# Altium project PCB_Spectrum_Analyzer.PrjPcb
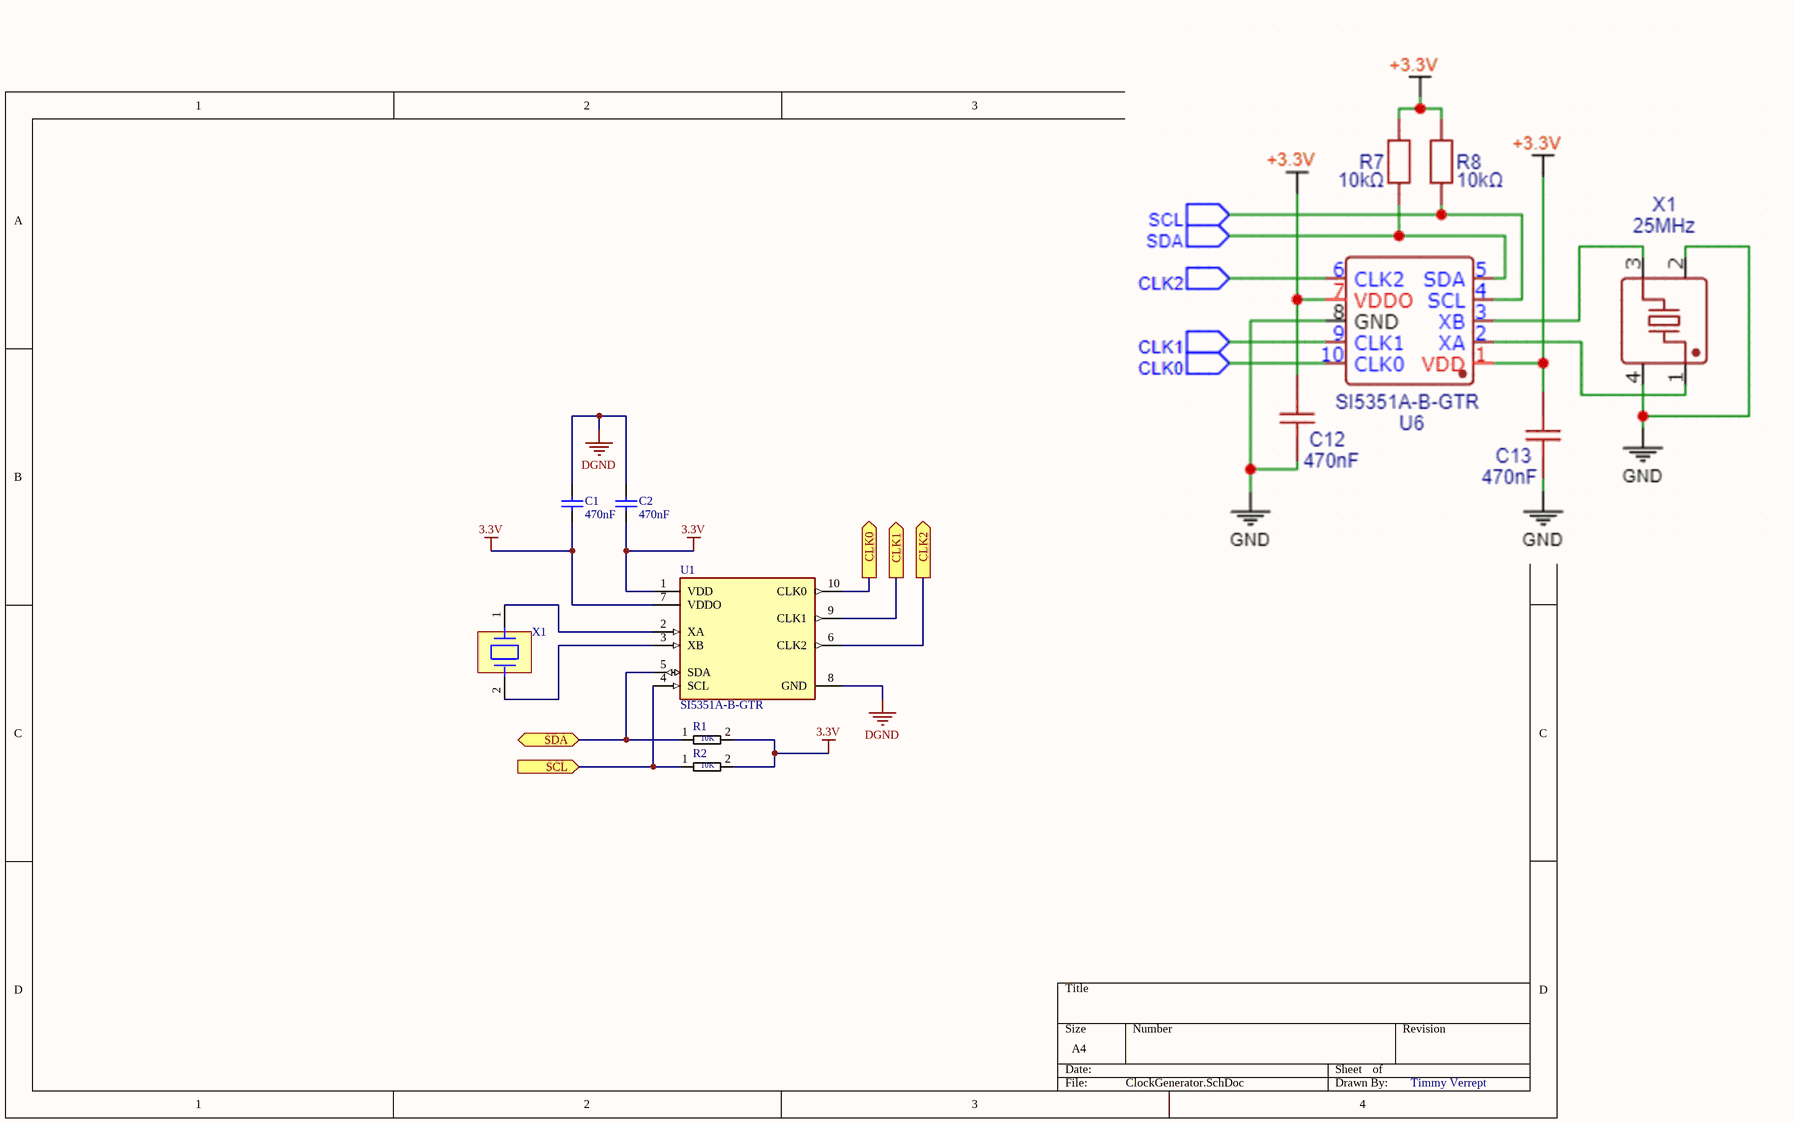
[diagram p0: ClockGenerator.SchDoc]
5 sheets, 74 parts. Net scope: flat (ports and power ports of the same name join across sheets).
Board file: Pcb_SpectrumAnalyzer.PcbDoc
Sheets:
  ClockGenerator.SchDoc
  AudioFrontend.SchDoc
  SpectrumAnalyzer.SchDoc
  ESP32-Controls.SchDoc
  BluetoothModule.SchDoc

## Sheet ClockGenerator.SchDoc
size A4; SheetNumber: 1; SheetTotal: 5

### Parts
C1  470nF  [SMD_CAPACITOR]
C2  470nF  [SMD_CAPACITOR]
R1  10K  [SMD_RESISTOR]
R2  10K  [SMD_RESISTOR]
U1  SI5351A-B-GTR  [ClockGenerator]
X1  ABM8W-25.0000MHZ-8-D1X-T3  [Crystal]  (value not drawn)

### Ports
CLK0 (out, see SpectrumAnalyzer[3A]), CLK1 (out, see SpectrumAnalyzer[3B]), CLK2 (out, see SpectrumAnalyzer[3C]), SCL (in, see ESP32-Controls[1B]), SDA (bidir, see ESP32-Controls[1B])

### Nets
3.3V: C1.1 C2.1 R1.2 R2.2 U1.1(VDD) U1.7(VDDO)
DGND: C1.2 C2.2 U1.8(GND)
NetESP32_4: R1.1 U1.5(SDA) ; port SDA
NetESP32_5: R2.1 U1.4(SCL) ; port SCL
NetU1_2: U1.2(XA) X1.1
NetU1_3: U1.3(XB) X1.2
NetU1_6: U1.6(CLK2) ; port CLK2
NetU1_9: U1.9(CLK1) ; port CLK1
NetU1_10: U1.10(CLK0) ; port CLK0

### Notes on the sheet
- Timmy Verrept

### Library data of the parts
C1 C2 = CER Capacitor: Manufacturer: Vitramon; Part Number: VJ0805Y682KXAMT
R1 R2 = Resistor: RES SMD 681 OHM 0.1% 1/8W 0805; Manufacturer: Yageo; Manufacturer Part Number: RT0805BRD07681RL; Value: 681Ω; Temperature Coefficient: 25 ppm/°C; Power Rating: 0.125W; Voltage Rating: 150V; Tolerance: 0.0025; ComponentLink2URL: http://www.yageo.com/documents/recent/PYu-RT_1-to-0.01_RoHS_L_9.pdf; Ipc Land Pattern Name: RESC200125X50; Footprint Url: http://www.yageo.com/exep/pages/download/literatures/PYu-R_Mount_10.pdf; Temperature: -55°C to +155°C; Resistance: 681Ω; Mouser Description: Thin Film Resistors - SMD 1/8W 681 ohm .1% 25ppm; Temperature Range High: +155°C; Device Class L3: Chip SMD Resistors; Automotive: No; Octopart: https://octopart.com/rt0805brd07681rl-yageo-1270194; Device Class L1: Passive Components; Package: RT0805; Device Class L2: Resistors; Category: Res; RoHS: TRUE; Composition: Thin Film; ComponentLink2Description: Datasheet; Temperature Range Low: -55°C; Lead Free: Yes; Digikey Description: RES SMD 681 OHM 0.1% 1/8W 0805; Height: 0.6mm; Series: RT
U1 = Clock Generator: IC CLK GENERATOR 200MHZ 10MSOP; PLL: Yes; Number of Circuits: 2; Max Duty Cycle: 55%; Operating Supply Voltage: 3.3V; Input: Crystal; Number of Outputs: 3; Operating Supply Current: 22mA; Packaging: Tape and Reel; Max Frequency: 200MHz; Min Operating Temperature: -40°C; Case/Package: MSOP; Mount: Surface Mount; Max Operating Temperature: 85°C; RoHS Compliant: Yes; Series: MultiSynth™; Number of Pins: 10; Package Quantity: 2500
X1 = Crystal: Crystal 25.0000Mhz 8Pf Smd Rohs Compliant: Yes |Abracon ABM8W-25.0000MHZ-8-D1X-T3; Symbol Hash: 5ad2309f83030e0db84e76142195c3471039205ed86bf5db55117304b0c05392; Frequency: 25MHz; Tolerance: 10ppm; Verification Version: 0.0.0.3; Stability: 20ppm; Esr: 50Ω; Mouser Part Number: 815-8W25-8D1XT; Mouser Description: Crystal 25.0000Mhz 8Pf Smd Rohs Compliant: Yes |Abracon ABM8W-25.0000MHZ-8-D1X-T3; Datasheet Date: 2022-07-11; Temperature Range High: +85°C; Part Number: ABM8W-25.0000MHZ-8-D1X-T3; Digikey Description: CRYSTAL 25.0000MHZ 8PF SMD; Digikey Part Number: 535-14059-1-ND; ComponentLink2URL: https://abracon.com/datasheets/ABM8W.pdf; ComponentLink2Description: Datasheet URL; Lead Free: Yes; Height: 0.75mm; Automotive: No; Temperature Range Low: -40°C; RoHS: Compliant; Manufacturer: Abracon; Package: ABM8W; Load Capacitance: 8pF; Series: ABM8W; ComponentLink1Description: Upverter; Supplier 2: Mouser; Supplier 1: Digi-Key; ComponentLink1URL: https://upverter.com/part/id/6105b10e08f999b5/; Supplier Part Number 2: 815-8W25-8D1XT; Supplier Part Number 1: 535-14059-1-ND; HelpURL: https://abracon.com/datasheets/ABM8W.pdf; Temperature: -40°C to +85°C; Schedule B: 8541600080

## Sheet AudioFrontend.SchDoc
size A4; SheetNumber: 2; SheetTotal: 5
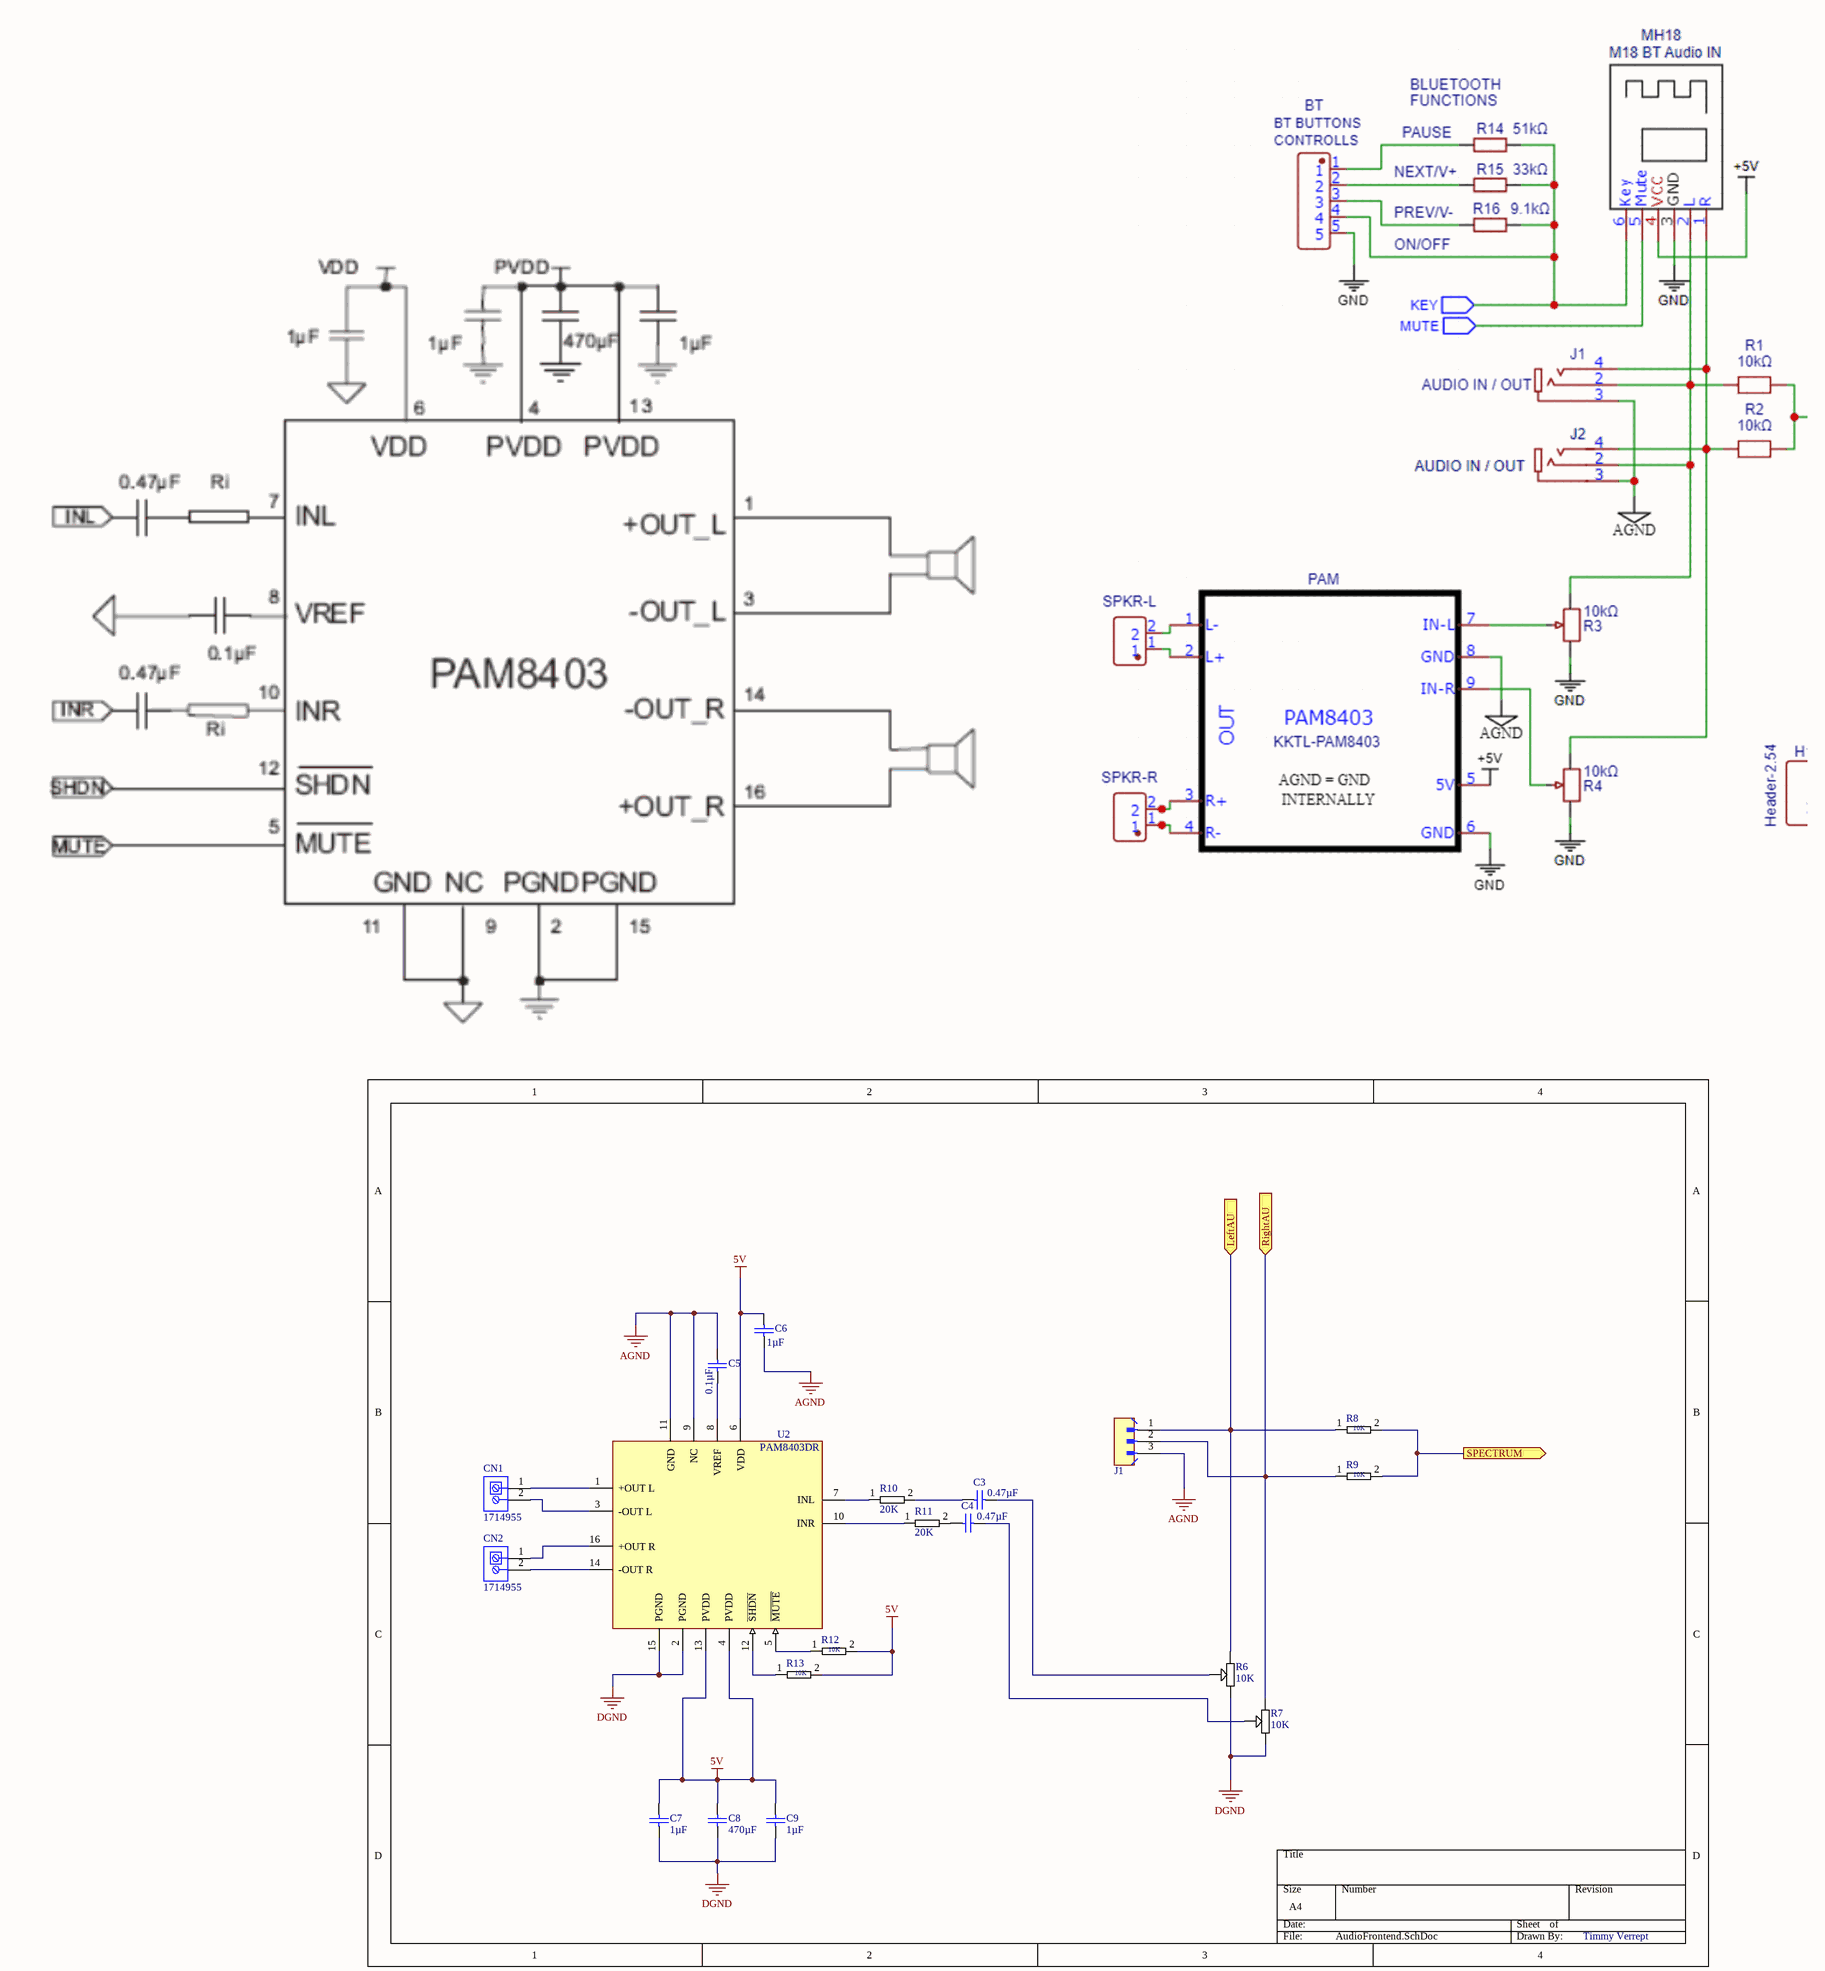
[diagram p1: AudioFrontend.SchDoc]

### Parts
C3  0.47µF  [SMD_CAPACITOR]
C4  0.47µF  [SMD_CAPACITOR]
C5  0.1µF  [SMD_CAPACITOR]
C6  1µF  [SMD_CAPACITOR]
C7  1µF  [SMD_CAPACITOR]
C8  470µF  [SMD_CAPACITOR]
C9  1µF  [SMD_CAPACITOR]
CN1  1714955  [SchroefConnector2P]
CN2  1714955  [SchroefConnector2P]
J1  B3B-PH-K-S  [Connector3P]  (value not drawn)
R6  10K  [POTENTIOMETER]
R7  10K  [POTENTIOMETER]
R8  10K  [SMD_RESISTOR]
R9  10K  [SMD_RESISTOR]
R10  20K  [SMD_RESISTOR]
R11  20K  [SMD_RESISTOR]
R12  10K  [SMD_RESISTOR]
R13  10K  [SMD_RESISTOR]
U2  PAM8403DR  [PAM8403]

### Ports
LeftAU (in, see BluetoothModule[4C]), RightAU (in, see BluetoothModule[4C]), SPECTRUM (out, see SpectrumAnalyzer[1B])

### Nets
5V: C6.1 C7.1 C8.1 C9.1 R12.2 R13.2 U2.4(PVDD) U2.6(VDD) U2.13(PVDD)
AGND: C5.1 C6.2 J1.3 U2.9(NC) U2.11(GND)
DGND: C7.2 C8.2 C9.2 R6.3 R7.3 U2.2(PGND) U2.15(PGND)
NetC3_1: C3.1 R10.2
NetC3_2: C3.2 R6.2
NetC4_1: C4.1 R11.2
NetC4_2: C4.2 R7.2
NetC5_2: C5.2 U2.8(VREF)
NetC16_2: R8.2 R9.2 ; port SPECTRUM
NetCN1_1: CN1.1 U2.1(+OUT_L)
NetCN1_2: CN1.2 U2.3(-OUT_L)
NetCN2_1: CN2.1 U2.16(+OUT_R)
NetCN2_2: CN2.2 U2.14(-OUT_R)
NetJ1_1: J1.1 R6.1 R8.1 ; port LeftAU
NetJ1_2: J1.2 R7.1 R9.1 ; port RightAU
NetR10_1: R10.1 U2.7(INL)
NetR11_1: R11.1 U2.10(INR)
NetR12_1: R12.1 U2.5(~{MUTE})
NetR13_1: R13.1 U2.12(~{SHDN})

### Notes on the sheet
- Timmy Verrept

### Library data of the parts
C3-C9 = CER Capacitor: as C1 on sheet ClockGenerator
CN1 CN2 = schroefconnector 2 pins: PC Terminal Block, Pitch 6.35 mm, 1 x 2 Position, Height 21.5 mm, Tail Lenght 5.1 mm, RoHS, Bulk; Manufacturer: Phoenix Contact; Package Description: PC Terminal Block, Pitch 6.35 mm, 1 x 2 Position, Height 21.5 mm, Tail Lenght 5.1 mm; Datasheet URL: http://media.digikey.com/pdf/Data%20Sheets/Phoenix%20Contact%20PDFs/1714955.pdf; Package Reference: 1714955; Manufacturer URL: http://www.phoenixcontact.com/; Datasheet Version: 02/2010; Mounting Technology: ThroughHole
J1 = Connector_3p: MF: {'manufacturer': u'JST Sales America Inc.'}; Package: None; Price: None; Value: *; MP: B3B-PH-K-S; Availability: Unavailable
R6 R7 = Potmeter: 16mm Rotary Potentiometers / WH148-1A-2-18T-L20; MF: Kls electronics; SnapEDA_Link: https://www.snapeda.com/parts/WH148-1A-2-18T-L20/Kls+electronics/view-part/?ref=snap; Package: Package; Value: *; MP: WH148-1A-2-18T-L20; Check_prices: https://www.snapeda.com/parts/WH148-1A-2-18T-L20/Kls+electronics/view-part/?ref=eda
R8-R13 = Resistor: as R1 on sheet ClockGenerator; ComponentLink2URL: http://www.yageo.com/documents/recent/PYu-RT_1-to-0.01_RoHS_L_9.pdf; Ipc Land Pattern Name: RESC200125X50; Footprint Url: http://www.yageo.com/exep/pages/download/literatures/PYu-R_Mount_10.pdf; Temperature: -55°C to +155°C; Resistance: 681Ω; Mouser Description: Thin Film Resistors - SMD 1/8W 681 ohm .1% 25ppm; Temperature Range High: +155°C; Device Class L3: Chip SMD Resistors; Automotive: No; Octopart: https://octopart.com/rt0805brd07681rl-yageo-1270194; Device Class L1: Passive Components; Package: RT0805; Device Class L2: Resistors; Category: Res; RoHS: TRUE; Composition: Thin Film; ComponentLink2Description: Datasheet; Temperature Range Low: -55°C; Lead Free: Yes; Digikey Description: RES SMD 681 OHM 0.1% 1/8W 0805; Height: 0.6mm; Series: RT
U2 = Pam8403: IC AMP CLASS D STEREO 3W 16SOP; Manufacturer: Diodes Inc.; Min Supply Voltage: 2.5V; Standoff Height: 0.1mm; Max Junction Temp: +125°C; Number Of Channels: 2; Power At Speaker R: 3.2W @ 4Ω; Nominal Supply Current: 8-16mA; Max Supply Voltage: 5.5V; Package: SO-16; Device Class L3: Amplifiers - Audio; Ipc Land Pattern Name: SOIC127P600X119-16; ComponentLink2URL: https://www.diodes.com/assets/Datasheets/PAM8403.pdf; Automotive: No; ComponentLink2Description: Datasheet; Device Class L1: Integrated Circuits (ICs); Digikey Description: IC AMP CLASS D STEREO 3W 16SOP; Temperature Range High: +85°C; Mouser Description: PAM8403 Series 5.5 V 3 W Filterless Class-D Stereo Audio Amplifier - SOIC-16; RoHS: TRUE; Temperature: -40°C to +85°C; Temperature Range Low: -40°C; Manufacturer Part Number: PAM8403DR; Octopart: https://octopart.com/pam8403dr-diodes+inc.-29030487; Device Class L2: Linear ICs; Category: IC; Footprint Url: https://www.diodes.com/assets/Package-Files/SO-16.pdf; Lead Free: Yes; Height: 1.26mm

## Sheet SpectrumAnalyzer.SchDoc
size A4; SheetNumber: 3; SheetTotal: 5
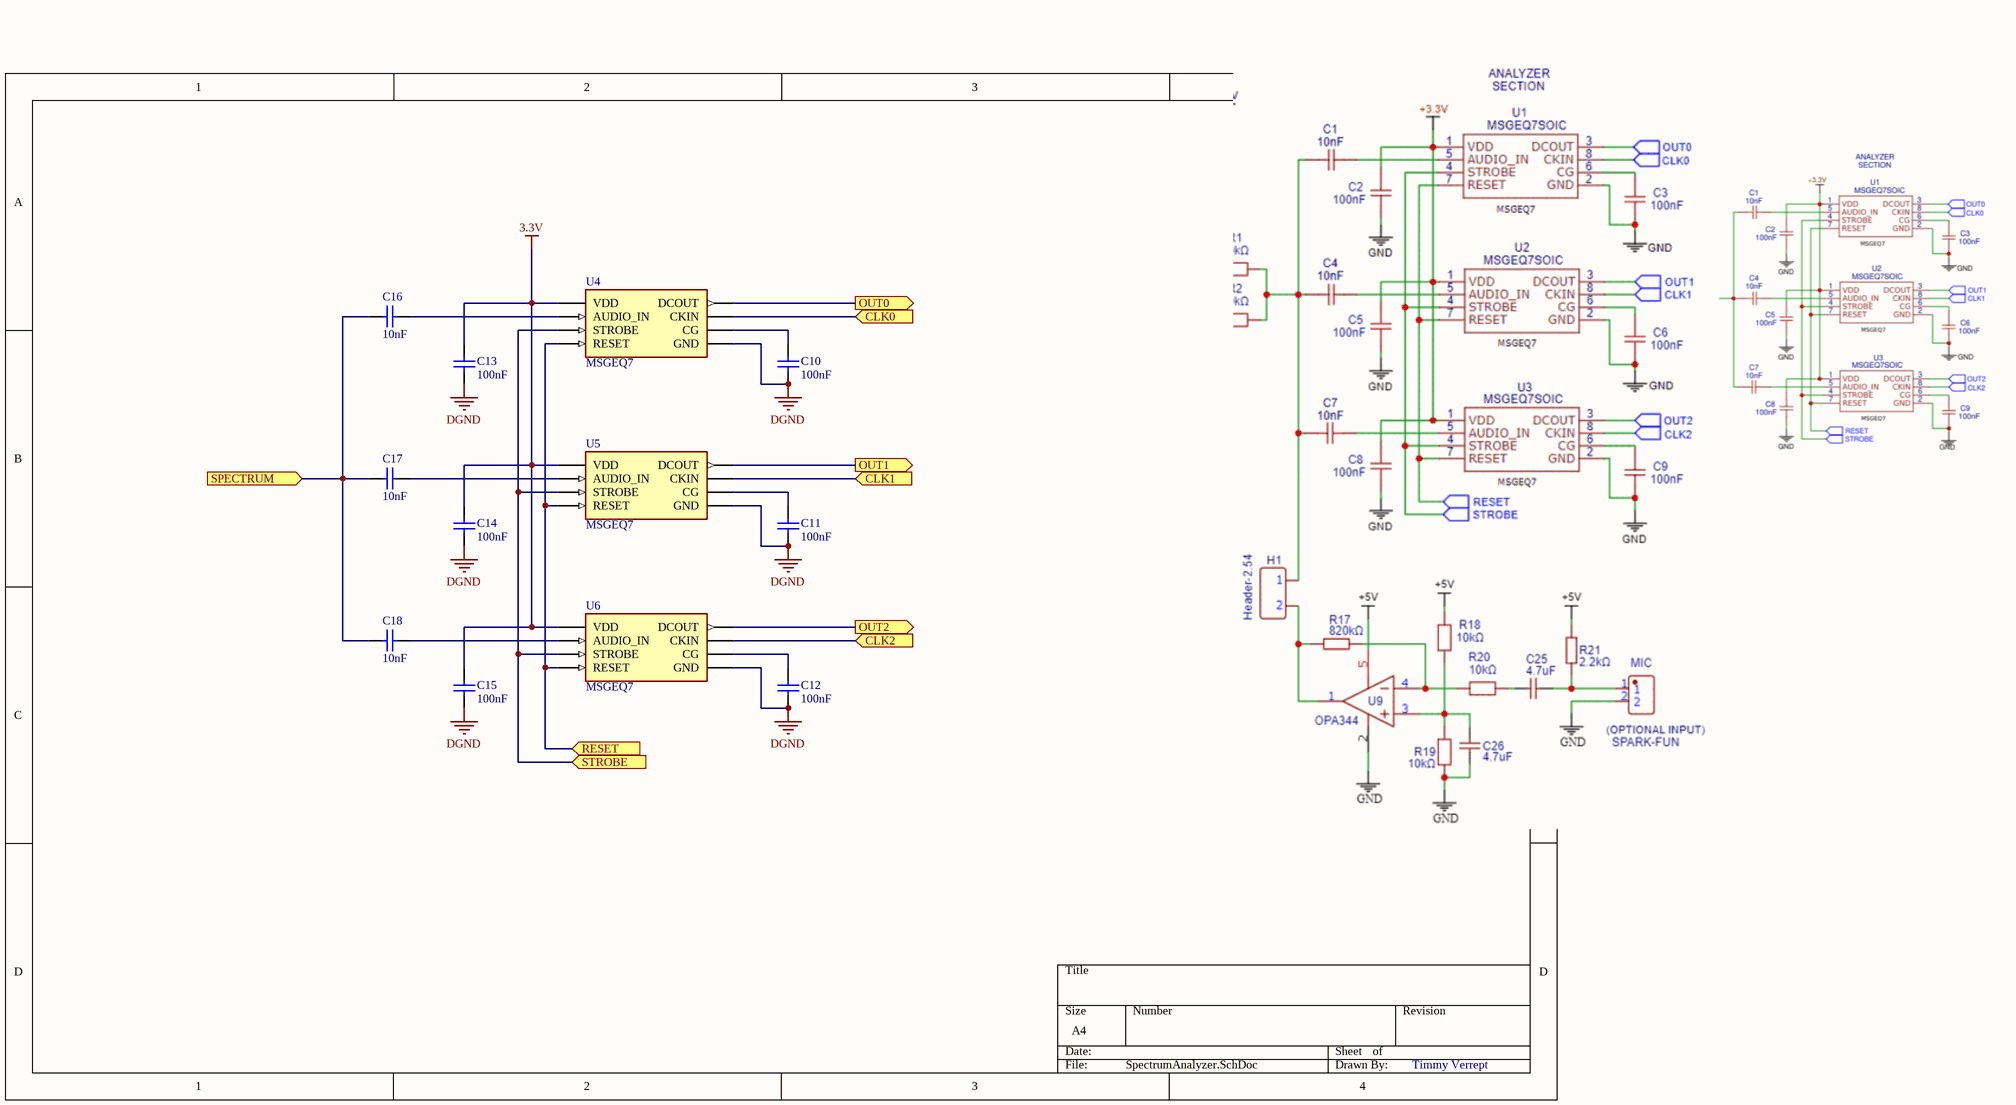
[diagram p2: SpectrumAnalyzer.SchDoc]

### Parts
C10  100nF  [SMD_CAPACITOR]
C11  100nF  [SMD_CAPACITOR]
C12  100nF  [SMD_CAPACITOR]
C13  100nF  [SMD_CAPACITOR]
C14  100nF  [SMD_CAPACITOR]
C15  100nF  [SMD_CAPACITOR]
C16  10nF  [SMD_CAPACITOR]
C17  10nF  [SMD_CAPACITOR]
C18  10nF  [SMD_CAPACITOR]
U4  MSGEQ7  [MSGEQ7]
U5  MSGEQ7  [MSGEQ7]
U6  MSGEQ7  [MSGEQ7]

### Ports
CLK0 (in, see ClockGenerator[3B]), CLK1 (in, see ClockGenerator[3B]), CLK2 (in, see ClockGenerator[3B]), OUT0 (out, see ESP32-Controls[2B]), OUT1 (out, see ESP32-Controls[2B]), OUT2 (out, see ESP32-Controls[2B]), RESET (in, see ESP32-Controls[1B]), SPECTRUM (in, see AudioFrontend[4B]), STROBE (in, see ESP32-Controls[1B])

### Nets
3.3V: C13.2 C14.2 C15.2 U4.1(VDD) U5.1(VDD) U6.1(VDD)
DGND: C10.1 C11.1 C12.1 C13.1 C14.1 C15.1 U4.2(GND) U5.2(GND) U6.2(GND)
NetC10_2: C10.2 U4.6(CG)
NetC11_2: C11.2 U5.6(CG)
NetC12_2: C12.2 U6.6(CG)
NetC16_1: C16.1 U4.5(AUDIO_IN)
NetC16_2: C16.2 C17.2 C18.2 ; port SPECTRUM
NetC17_1: C17.1 U5.5(AUDIO_IN)
NetC18_1: C18.1 U6.5(AUDIO_IN)
NetESP32_8: U4.7(RESET) U5.7(RESET) U6.7(RESET) ; port RESET
NetESP32_9: U4.4(STROBE) U5.4(STROBE) U6.4(STROBE) ; port STROBE
NetESP32_16: U6.3(DCOUT) ; port OUT2
NetESP32_17: U5.3(DCOUT) ; port OUT1
NetESP32_18: U4.3(DCOUT) ; port OUT0
NetU1_6: U6.8(CKIN) ; port CLK2
NetU1_9: U5.8(CKIN) ; port CLK1
NetU1_10: U4.8(CKIN) ; port CLK0

### Notes on the sheet
- Timmy Verrept

### Library data of the parts
C10-C18 = CER Capacitor: as C1 on sheet ClockGenerator
U4-U6 = MSGEQ7: MSGEQ7 Signal Level Control Interface Arduino Platform Evaluation Expansion Board; MF: SparkFun Electronics; Price: None; Availability: Unavailable; SnapEDA_Link: https://www.snapeda.com/parts/MSGEQ7/SparkFun%20Electronics/view-part/106617/?ref=snap; Value: *; Package: SOIC-8 Mixed Signal Integration; MP: MSGEQ7

## Sheet ESP32-Controls.SchDoc
size A4; SheetNumber: 4; SheetTotal: 5
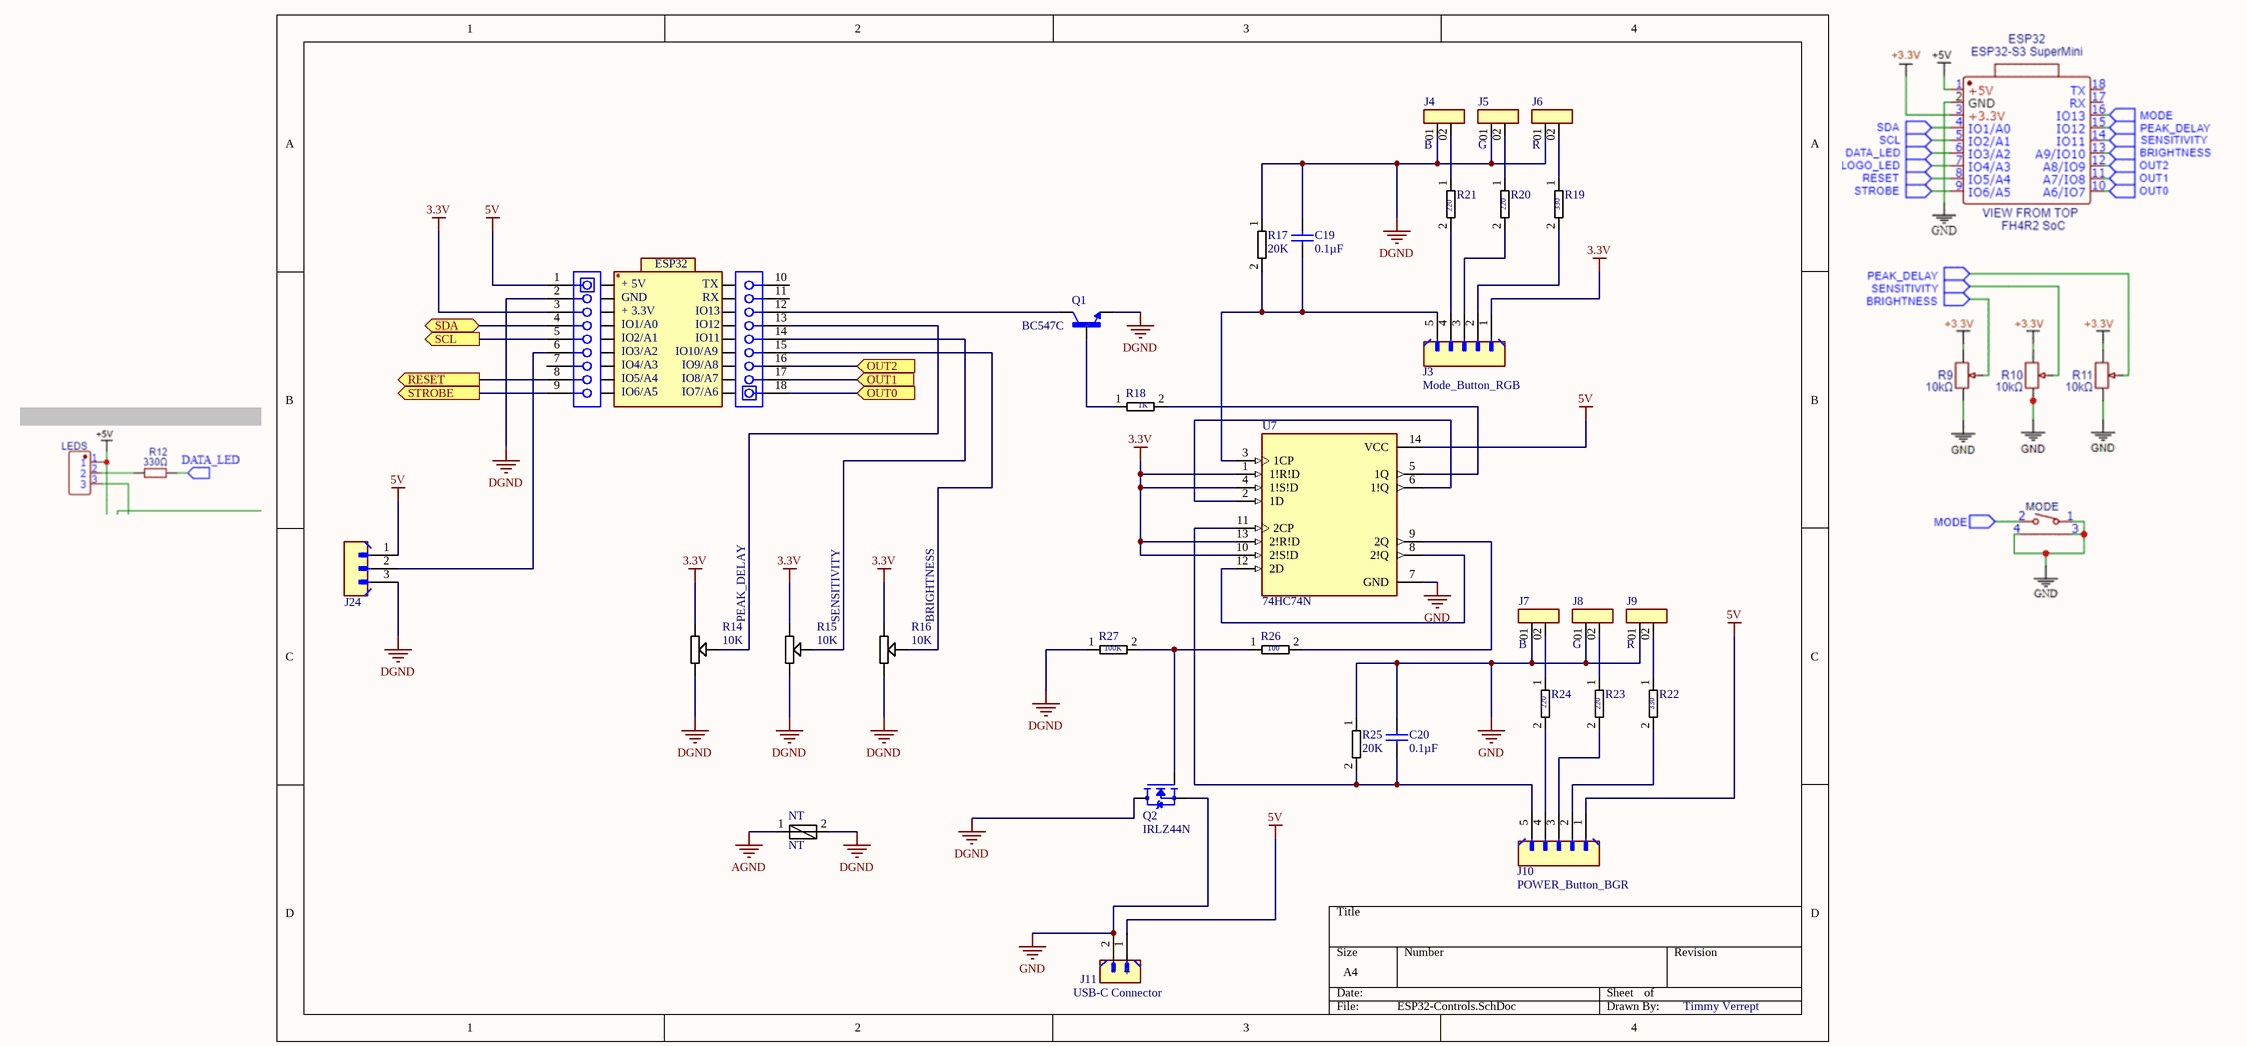
[diagram p3: ESP32-Controls.SchDoc]

### Parts
C19  0.1µF  [SMD_CAPACITOR]
C20  0.1µF  [SMD_CAPACITOR]
ESP32  ESP32_Placeholder  [ESP32_placeholder]  (value not drawn)
J3  Mode_Button_RGB  [Connector5P]
J4  B  [MaleHeader2P]
J5  G  [MaleHeader2P]
J6  R  [MaleHeader2P]
J7  B  [MaleHeader2P]
J8  G  [MaleHeader2P]
J9  R  [MaleHeader2P]
J10  POWER_Button_BGR  [Connector5P]
J11  USB-C Connector  [JST_B2B-PH-K-S]
J24  B3B-PH-K-S  [Connector3P]  (value not drawn)
NT  NT  [NT]
Q1  BC547C  [Transistor]
Q2  IRLZ44N  [MOSFET]
R14  10K  [POTENTIOMETER]
R15  10K  [POTENTIOMETER]
R16  10K  [POTENTIOMETER]
R17  20K  [SMD_RESISTOR]
R18  1K  [SMD_RESISTOR]
R19  330  [SMD_RESISTOR]
R20  220  [SMD_RESISTOR]
R21  220  [SMD_RESISTOR]
R22  330  [SMD_RESISTOR]
R23  220  [SMD_RESISTOR]
R24  220  [SMD_RESISTOR]
R25  20K  [SMD_RESISTOR]
R26  100  [SMD_RESISTOR]
R27  100K  [SMD_RESISTOR]
U7  74HC74N  [74HC74]

### Ports
OUT0 (in, see SpectrumAnalyzer[3A]), OUT1 (in, see SpectrumAnalyzer[3B]), OUT2 (in, see SpectrumAnalyzer[3C]), RESET (out, see SpectrumAnalyzer[2C]), SCL (out, see ClockGenerator[2C]), SDA (bidir, see ClockGenerator[2C]), STROBE (out, see SpectrumAnalyzer[2C])

### Nets
3.3V: ESP32.3 J3.1 R14.3 R15.3 R16.3 U7.1(1!R!D) U7.4(1!S!D) U7.10(2!S!D) U7.13(2!R!D)
5V: ESP32.1 J10.1 J11.1(+) J24.1 U7.14(VCC)
AGND: NT.1
DGND: C19.1 ESP32.2 J4.01 J5.01 J6.01 J24.3 NT.2 Q1.3(E) Q2.2(D) R14.1 R15.1 R16.1 R17.1 R27.1
GND: C20.1 J7.01 J8.01 J9.01 J11.2(-) Q2.3(S) R25.1 U7.7(GND)
NetC19_2: C19.2 J3.5 R17.2 U7.3(1CP)
NetC20_2: C20.2 J10.5 R25.2 U7.11(2CP)
NetESP32_4: ESP32.4 ; port SDA
NetESP32_5: ESP32.5 ; port SCL
NetESP32_6: ESP32.6 J24.2
NetESP32_8: ESP32.8 ; port RESET
NetESP32_9: ESP32.9 ; port STROBE
NetESP32_12: ESP32.12 Q1.1(C)
NetESP32_13: ESP32.13 R14.2
NetESP32_14: ESP32.14 R15.2
NetESP32_15: ESP32.15 R16.2
NetESP32_16: ESP32.16 ; port OUT2
NetESP32_17: ESP32.17 ; port OUT1
NetESP32_18: ESP32.18 ; port OUT0
NetJ3_2: J3.2 R19.2
NetJ3_3: J3.3 R20.2
NetJ3_4: J3.4 R21.2
NetJ4_02: J4.02 R21.1
NetJ5_02: J5.02 R20.1
NetJ6_02: J6.02 R19.1
NetJ7_02: J7.02 R24.1
NetJ8_02: J8.02 R23.1
NetJ9_02: J9.02 R22.1
NetJ10_2: J10.2 R22.2
NetJ10_3: J10.3 R23.2
NetJ10_4: J10.4 R24.2
NetQ1_2: Q1.2(B) R18.1
NetQ2_1: Q2.1(G) R26.1 R27.2
NetR18_2: R18.2 U7.5(1Q)
NetR26_2: R26.2 U7.9(2Q)
NetU7_2: U7.2(1D) U7.6(1!Q)
NetU7_8: U7.8(2!Q) U7.12(2D)

Not connected (* = marked no-connect by the designer): ESP32 7 10 11

### Notes on the sheet
- PEAK_DELAY
- SENSITIVITY
- (near R16) BRIGHTNESS
- Timmy Verrept
- (in symbol ESP32_Placeholder) + 5V; TX; GND; RX; + 3.3V; IO13; IO1/A0; IO12; IO2/A1; IO11; IO3/A2; IO10/A9; IO4/A3; IO9/A8; IO5/A4; IO8/A7; IO6/A5; IO7/A6

### Library data of the parts
C19 C20 = CER Capacitor: as C1 on sheet ClockGenerator
J3 J10 = Connector_5p: B5B-PH-K-S; MF: {'manufacturer': u'JST Sales America Inc.'}; Package: None; Price: None; Value: *; MP: B5B-PH-K-S; Availability: Unavailable
J4-J9 = Header_Male2p: Variable Height PCB Header Strips, 0.100 pitch; MF: SAMTEC; MP: MTSW-101-09-L-D-210; SnapEDA_Link: https://www.snapeda.com/parts/MTSW-101-09-L-D-210/Samtec/view-part/?ref=snap; Package: None; Value: *; Check_prices: https://www.snapeda.com/parts/MTSW-101-09-L-D-210/Samtec/view-part/?ref=eda
J11 = Connector_2p: Connector Header Through Hole 2 position 0.079 (2.00mm)B2B-PH-K-S; MF: JST Sales America Inc.; SnapEDA_Link: https://www.snapeda.com/parts/B2B-PH-K-S/JST/view-part/?ref=snap; Package: None; Value: *; MP: B2B-PH-K-S; Check_prices: https://www.snapeda.com/parts/B2B-PH-K-S/JST/view-part/?ref=eda
J24 = Connector_3p: as J1 on sheet AudioFrontend; Package: None; Price: None; Value: *; MP: B3B-PH-K-S; Availability: Unavailable
Q1 = BC547C: BJT, TO-92, 45V, 100mA, NPN, 0.5W, 150Â°C; MF: Diotec Semiconductor; Package: TO-92; Price: None; Value: *; SnapEDA_Link: https://www.snapeda.com/parts/BC547C/Diotec/view-part/?ref=snap; MP: BC547C; Availability: Unavailable; Check_prices: https://www.snapeda.com/parts/BC547C/Diotec/view-part/?ref=eda
Q2 = IRLZ44N: N-Channel 55 V 47A (Tc) 3.8W (Ta), 110W (Tc) Surface Mount D2PAK; MF: Infineon / IR; Package: TO-220-3 Infineon / IR; Availability: Not in stock; Value: *; MP: IRLZ44N; Check_prices: https://www.snapeda.com/parts/IRLZ44N/Infineon/view-part/?ref=eda; Price: None; SnapEDA_Link: https://www.snapeda.com/parts/IRLZ44N/Infineon/view-part/?ref=snap
R14-R16 = Potmeter: as R6 on sheet AudioFrontend; SnapEDA_Link: https://www.snapeda.com/parts/WH148-1A-2-18T-L20/Kls+electronics/view-part/?ref=snap; Package: Package; Value: *; MP: WH148-1A-2-18T-L20; Check_prices: https://www.snapeda.com/parts/WH148-1A-2-18T-L20/Kls+electronics/view-part/?ref=eda
R17-R27 = Resistor: as R1 on sheet ClockGenerator; ComponentLink2URL: http://www.yageo.com/documents/recent/PYu-RT_1-to-0.01_RoHS_L_9.pdf; Ipc Land Pattern Name: RESC200125X50; Footprint Url: http://www.yageo.com/exep/pages/download/literatures/PYu-R_Mount_10.pdf; Temperature: -55°C to +155°C; Resistance: 681Ω; Mouser Description: Thin Film Resistors - SMD 1/8W 681 ohm .1% 25ppm; Temperature Range High: +155°C; Device Class L3: Chip SMD Resistors; Automotive: No; Octopart: https://octopart.com/rt0805brd07681rl-yageo-1270194; Device Class L1: Passive Components; Package: RT0805; Device Class L2: Resistors; Category: Res; RoHS: TRUE; Composition: Thin Film; ComponentLink2Description: Datasheet; Temperature Range Low: -55°C; Lead Free: Yes; Digikey Description: RES SMD 681 OHM 0.1% 1/8W 0805; Height: 0.6mm; Series: RT
U7 = 74HC74N,652: D FLIP-FLOP; MF: Rochester Electronics, LLC; Check_prices: https://www.snapeda.com/parts/74HC74N,652/Rochester%20Electronics/view-part/5010421/?ref=eda; Price: None; SnapEDA_Link: https://www.snapeda.com/parts/74HC74N,652/Rochester%20Electronics/view-part/5010421/?ref=snap; MP: 74HC74N,652; Value: *; Availability: Warning; Package: None; Purchase-URL: https://pricing.snapeda.com/search/part/74HC74N,652/?ref=eda

## Sheet BluetoothModule.SchDoc
size A4; SheetNumber: 5; SheetTotal: 5
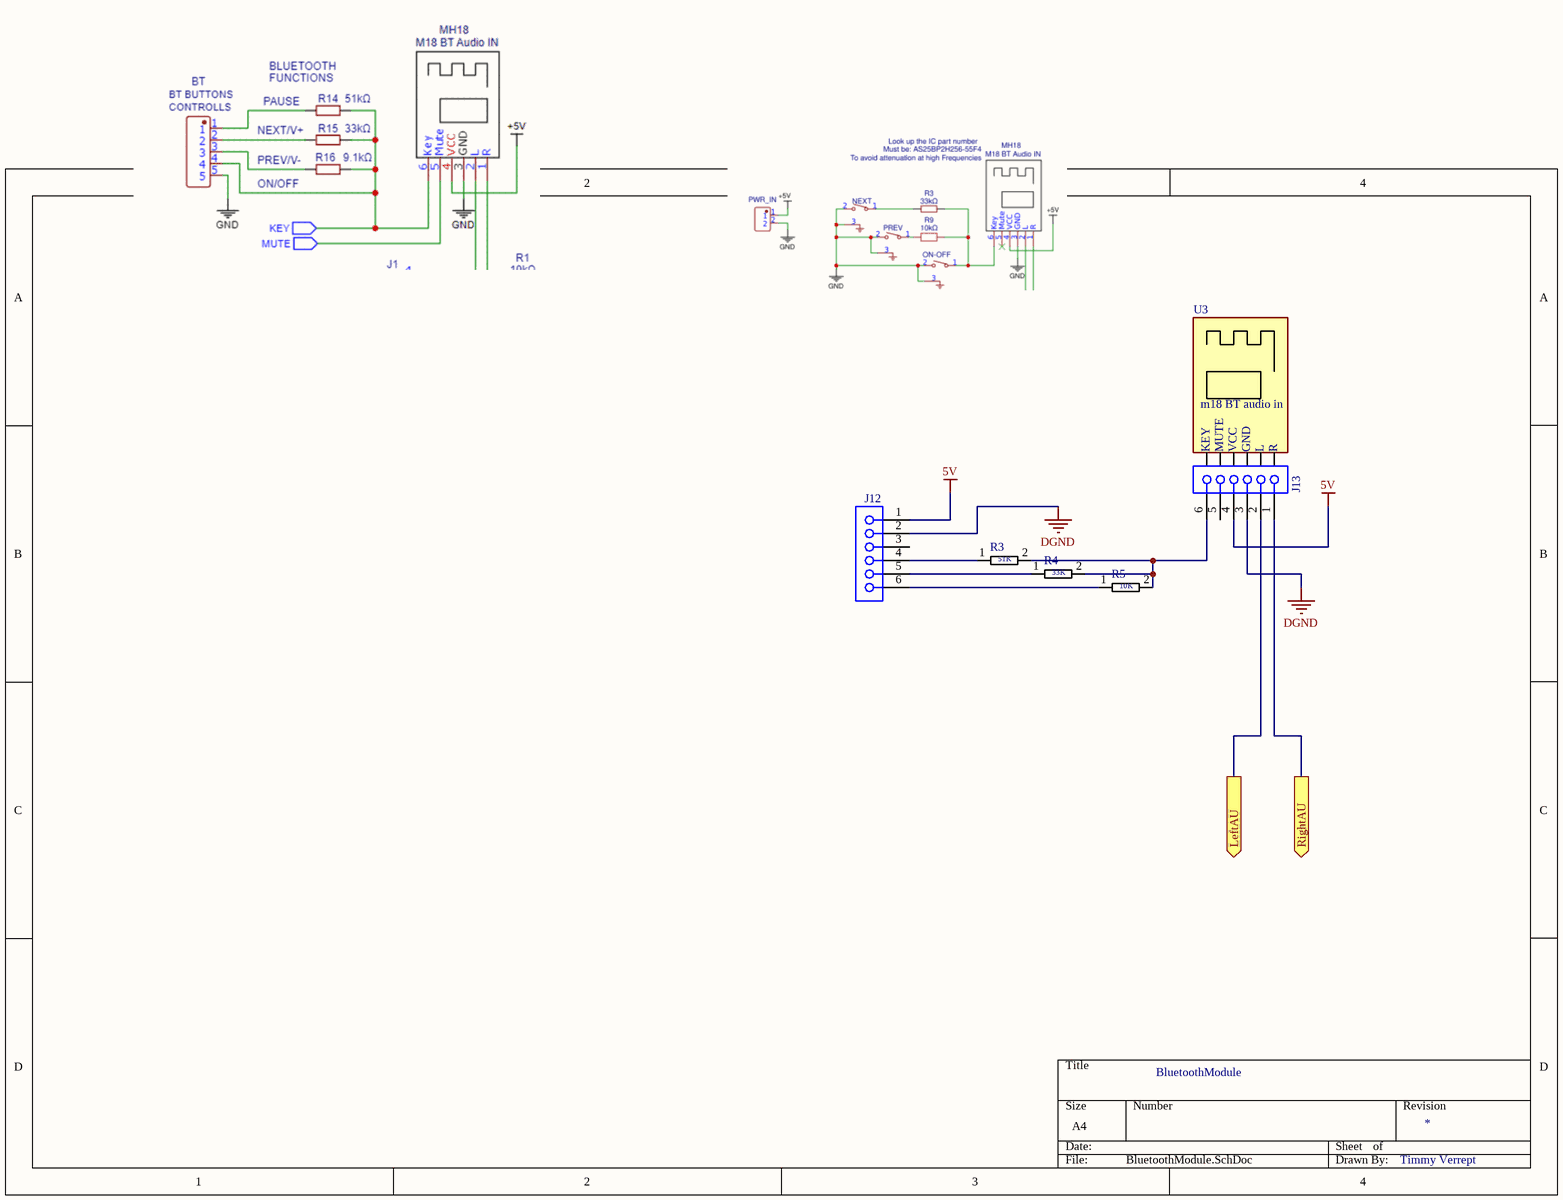
[diagram p4: BluetoothModule.SchDoc]

### Parts
J12  (no value)  [HEADER-6PINS]
J13  61300611821  [HEADER-6PINS]  (value not drawn)
R3  51K  [SMD_RESISTOR]
R4  33K  [SMD_RESISTOR]
R5  10K  [SMD_RESISTOR]
U3  m18 BT audio in  [ESP32_placeholder]

### Ports
LeftAU (out, see AudioFrontend[3A]), RightAU (out, see AudioFrontend[3A])

### Nets
5V: J12.1 J13.4
DGND: J12.2 J13.3
NetJ1_1: J13.2 ; port LeftAU
NetJ1_2: J13.1 ; port RightAU
NetJ12_4: J12.4 R3.1
NetJ12_5: J12.5 R4.1
NetJ12_6: J12.6 R5.1
NetJ13_6: J13.6 R3.2 R4.2 R5.2

Not connected (* = marked no-connect by the designer): J12 3; J13 5

### Notes on the sheet
- BluetoothModule
- Timmy Verrept
- (in symbol Bluetooth Module) KEY; MUTE; VCC; GND; L; R

### Library data of the parts
J12 J13 = Header_female6P: THT Vertical Socket Header WR-PHD, Pitch 2.54 mm, Single Row, 6 pins; Current Rating: 3A; Contact Resistance: 20mΩ; Gender: Female; Operating Supply Voltage: 250V; RoHS: Compliant; Orientation: Vertical; Number of Pins: 6; Lead Pitch: 2.54mm
R3-R5 = Resistor: as R1 on sheet ClockGenerator; ComponentLink2URL: http://www.yageo.com/documents/recent/PYu-RT_1-to-0.01_RoHS_L_9.pdf; Ipc Land Pattern Name: RESC200125X50; Footprint Url: http://www.yageo.com/exep/pages/download/literatures/PYu-R_Mount_10.pdf; Temperature: -55°C to +155°C; Resistance: 681Ω; Mouser Description: Thin Film Resistors - SMD 1/8W 681 ohm .1% 25ppm; Temperature Range High: +155°C; Device Class L3: Chip SMD Resistors; Automotive: No; Octopart: https://octopart.com/rt0805brd07681rl-yageo-1270194; Device Class L1: Passive Components; Package: RT0805; Device Class L2: Resistors; Category: Res; RoHS: TRUE; Composition: Thin Film; ComponentLink2Description: Datasheet; Temperature Range Low: -55°C; Lead Free: Yes; Digikey Description: RES SMD 681 OHM 0.1% 1/8W 0805; Height: 0.6mm; Series: RT
U3 = Bluetooth Module

## Nets that join several sheets
3.3V: ClockGenerator (6 pins), SpectrumAnalyzer (6 pins), ESP32-Controls (9 pins)
5V: AudioFrontend (9 pins), ESP32-Controls (5 pins), BluetoothModule (J12.1 J13.4)
AGND: AudioFrontend (5 pins), ESP32-Controls (NT.1)
DGND: ClockGenerator (C1.2 C2.2 U1.8), AudioFrontend (7 pins), SpectrumAnalyzer (9 pins), ESP32-Controls (14 pins), BluetoothModule (J12.2 J13.3)
NetC16_2: AudioFrontend (R8.2 R9.2), SpectrumAnalyzer (C16.2 C17.2 C18.2)
NetESP32_4: ClockGenerator (R1.1 U1.5), ESP32-Controls (ESP32.4)
NetESP32_5: ClockGenerator (R2.1 U1.4), ESP32-Controls (ESP32.5)
NetESP32_8: SpectrumAnalyzer (U4.7 U5.7 U6.7), ESP32-Controls (ESP32.8)
NetESP32_9: SpectrumAnalyzer (U4.4 U5.4 U6.4), ESP32-Controls (ESP32.9)
NetESP32_16: SpectrumAnalyzer (U6.3), ESP32-Controls (ESP32.16)
NetESP32_17: SpectrumAnalyzer (U5.3), ESP32-Controls (ESP32.17)
NetESP32_18: SpectrumAnalyzer (U4.3), ESP32-Controls (ESP32.18)
NetJ1_1: AudioFrontend (J1.1 R6.1 R8.1), BluetoothModule (J13.2)
NetJ1_2: AudioFrontend (J1.2 R7.1 R9.1), BluetoothModule (J13.1)
NetU1_6: ClockGenerator (U1.6), SpectrumAnalyzer (U6.8)
NetU1_9: ClockGenerator (U1.9), SpectrumAnalyzer (U5.8)
NetU1_10: ClockGenerator (U1.10), SpectrumAnalyzer (U4.8)